# Altium schematic sheet ETH-Debug.SchDoc
size OrCAD B; SheetNumber: 6; SheetTotal: 10
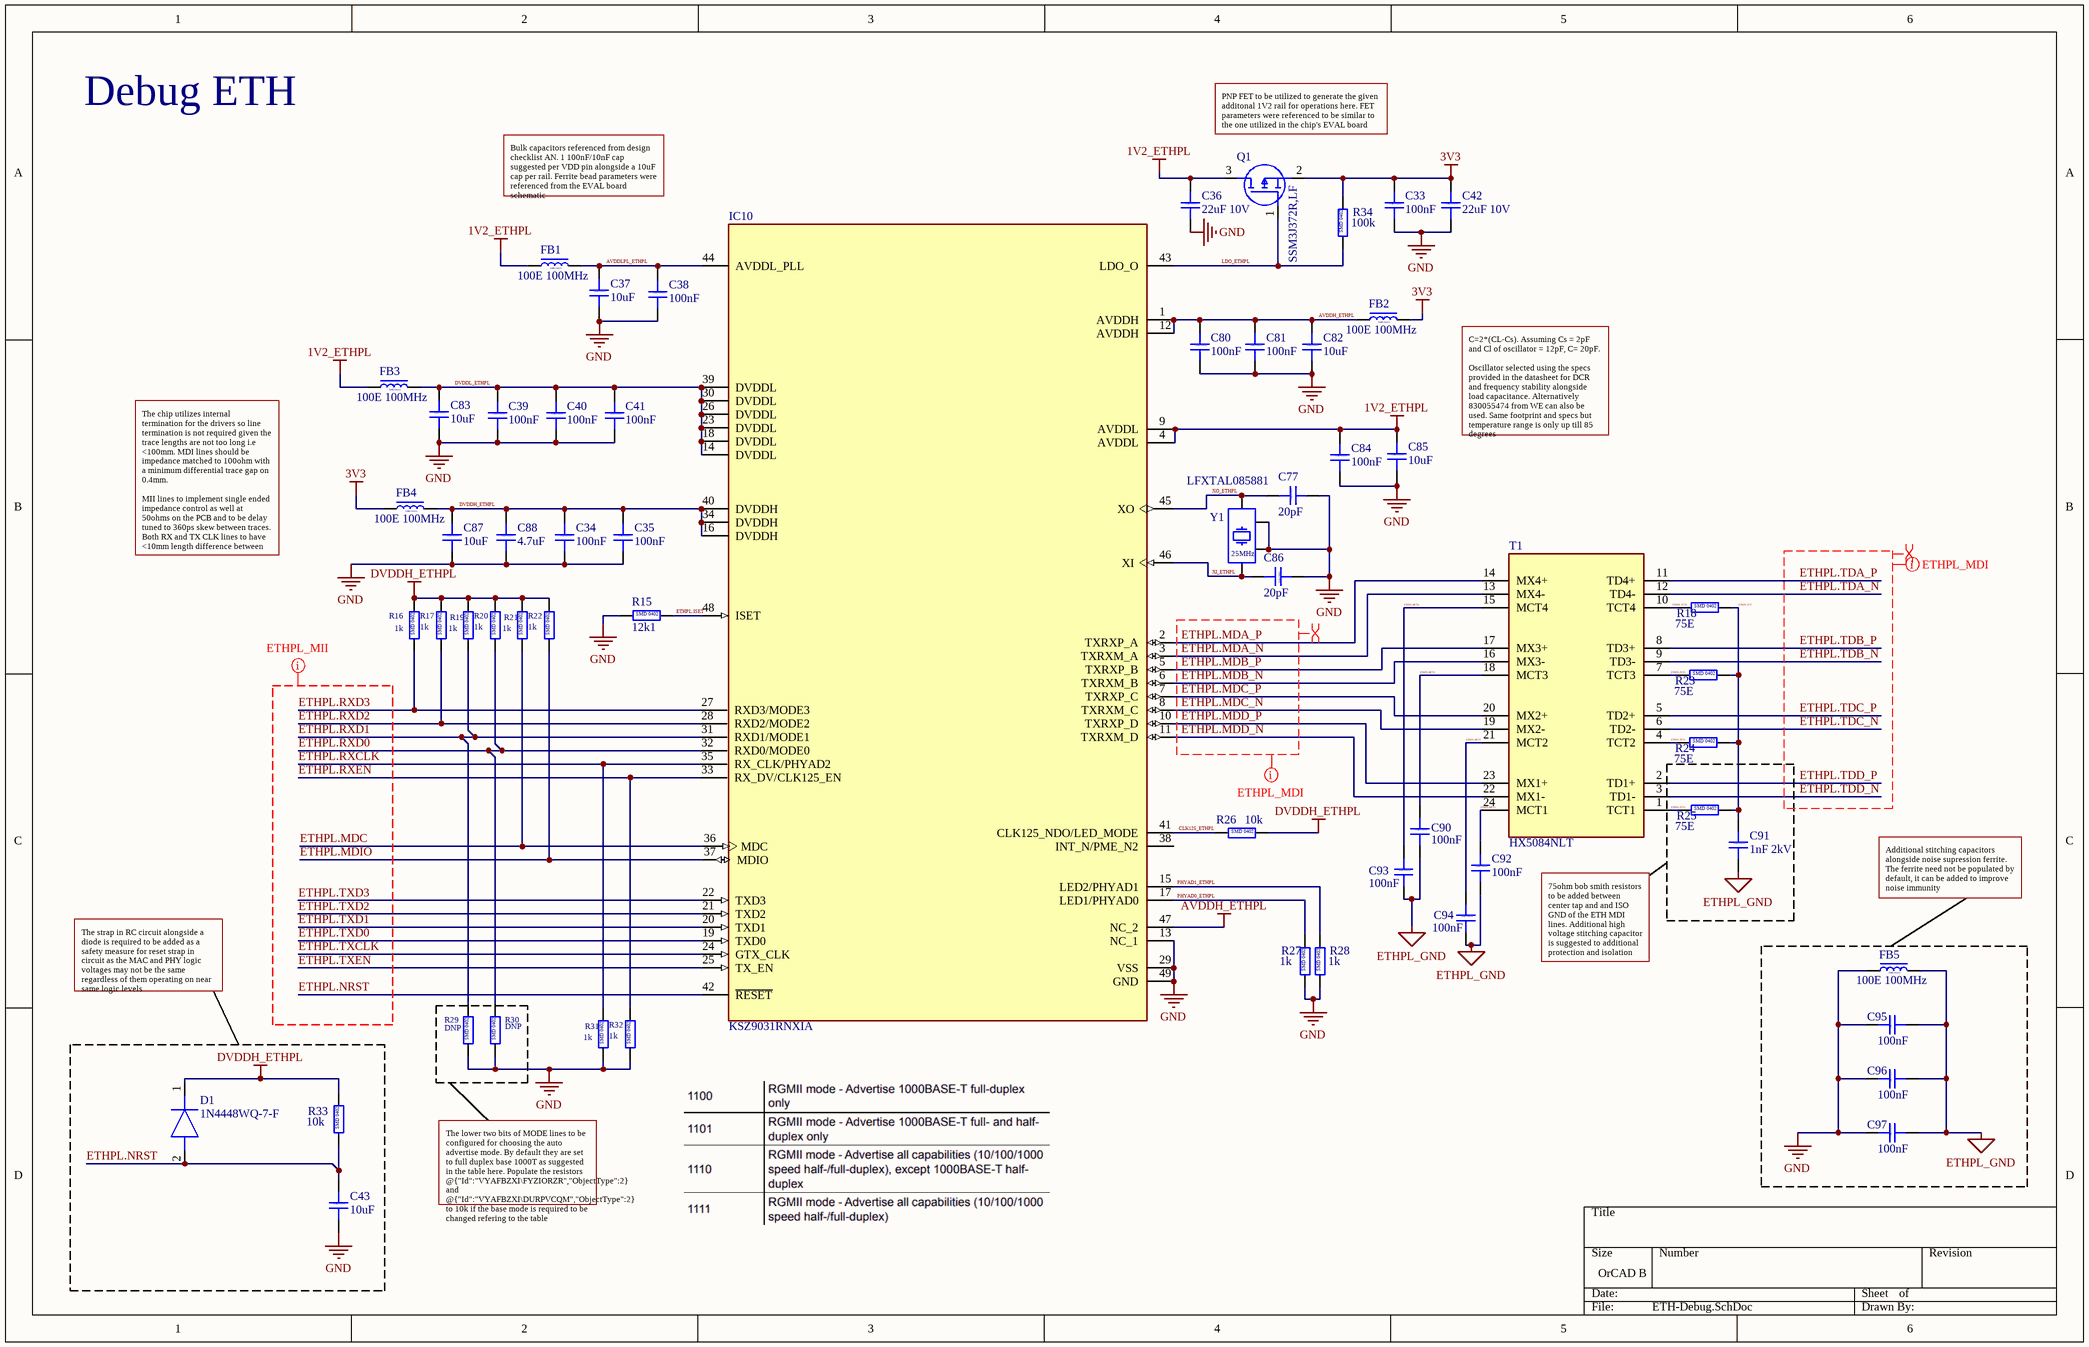
[diagram p0: ETH-Debug.SchDoc]

## Parts
C33  100nF  [CAP_0402]
C34  100nF  [CAP_0402]
C35  100nF  [CAP_0402]
C36  22uF 10V  [CAP_0805]
C37  10uF  [CAP_0603]
C38  100nF  [CAP_0402]
C39  100nF  [CAP_0402]
C40  100nF  [CAP_0402]
C41  100nF  [CAP_0402]
C42  22uF 10V  [CAP_0805]
C43  10uF  [CAP_0603]
C77  20pF  [CAP_0402]
C80  100nF  [CAP_0402]
C81  100nF  [CAP_0402]
C82  10uF  [CAP_0603]
C83  10uF  [CAP_0603]
C84  100nF  [CAP_0402]
C85  10uF  [CAP_0603]
C86  20pF  [CAP_0402]
C87  10uF  [CAP_0603]
C88  4.7uF  [CAP_0603]
C90  100nF  [CAP_0402]
C91  1nF 2kV  [CAP_0402]
C92  100nF  [CAP_0402]
C93  100nF  [CAP_0402]
C94  100nF  [CAP_0402]
C95  100nF  [CAP_0402]
C96  100nF  [CAP_0402]
C97  100nF  [CAP_0402]
D1  1N4448WQ-7-F  [SOD3716X135N]
FB1  100E 100MHz  [FB_0603]
FB2  100E 100MHz  [FB_0603]
FB3  100E 100MHz  [FB_0603]
FB4  100E 100MHz  [FB_0603]
FB5  100E 100MHz  [FB_0603]
IC10  KSZ9031RNXIA  [QFN50P700X700X90-49N]
Q1  SSM3J372R,LF  [SSM3J372RLF]
R15  12k1  [RES_0402]
R16  1k  [RES_0402]
R17  1k  [RES_0402]
R18  75E  [RES_0402]
R19  1k  [RES_0402]
R20  1k  [RES_0402]
R21  1k  [RES_0402]
R22  1k  [RES_0402]
R23  75E  [RES_0402]
R24  75E  [RES_0402]
R25  75E  [RES_0402]
R26  10k  [RES_0402]
R27  1k  [RES_0402]
R28  1k  [RES_0402]
R29  DNP  [RES_0402]
R30  DNP  [RES_0402]
R31  1k  [RES_0402]
R32  1k  [RES_0402]
R33  10k  [RES_0402]
R34  100k  [RES_0402]
T1  HX5084NLT  [HX5084NLT]
Y1  LFXTAL085881  [CRY-SMD-3225]

## Nets
1V2_ETHPL: C36.1 C84.1 C85.1 FB1.1 FB3.1 IC10.4(AVDDL) IC10.9(AVDDL) Q1.3(D)
3V3: C33.1 C42.1 FB2.2 FB4.1 Q1.2(S) R34.2
AVDDH_ETHPL: C80.1 C81.1 C82.1 FB2.1 IC10.1(AVDDH) IC10.12(AVDDH) IC10.47(NC_2)
DVDDH_ETHPL: C34.1 C35.1 C87.1 C88.1 D1.1(K) FB4.2 IC10.16(DVDDH) IC10.34(DVDDH) IC10.40(DVDDH) R16.2 R17.2 R19.2 R20.2 R21.2 R22.2 R26.2 R33.2
ETHPL_GND: C90.2 C91.2 C92.2 C93.2 C94.2 C95.2 C96.2 C97.2 FB5.2
GND: C33.2 C34.2 C35.2 C36.2 C37.2 C38.2 C39.2 C40.2 C41.2 C42.2 C43.2 C77.2 C80.2 C81.2 C82.2 C83.2 C84.2 C85.2 C86.1 C87.2 C88.2 C95.1 C96.1 C97.1 FB5.1 IC10.13(NC_1) IC10.29(VSS) IC10.49(GND) R15.1 R27.1 R28.1 R29.1 R30.1 R31.1 R32.1 Y1.2 Y1.4
AVDDLPL_ETHPL: C37.1 C38.1 FB1.2 IC10.44(AVDDL_PLL)
CLK125_ETHPL: IC10.41(CLK125_NDO/LED_MODE) R26.1
DVDDL_ETHPL: C39.1 C40.1 C41.1 C83.1 FB3.2 IC10.14(DVDDL) IC10.18(DVDDL) IC10.23(DVDDL) IC10.26(DVDDL) IC10.30(DVDDL) IC10.39(DVDDL)
ETHPL.ISET: IC10.48(ISET) R15.2
ETHPL.MCT1: C92.1 T1.24(MCT1)
ETHPL.MCT2: C94.1 T1.21(MCT2)
ETHPL.MCT3: C90.1 T1.18(MCT3)
ETHPL.MCT4: C93.1 T1.15(MCT4)
ETHPL.MDA_N: IC10.3(TXRXM_A) T1.13(MX4-)
ETHPL.MDA_P: IC10.2(TXRXP_A) T1.14(MX4+)
ETHPL.MDB_N: IC10.6(TXRXM_B) T1.16(MX3-)
ETHPL.MDB_P: IC10.5(TXRXP_B) T1.17(MX3+)
ETHPL.MDC: IC10.36(MDC) R21.1
ETHPL.MDC_N: IC10.8(TXRXM_C) T1.19(MX2-)
ETHPL.MDC_P: IC10.7(TXRXP_C) T1.20(MX2+)
ETHPL.MDD_N: IC10.11(TXRXM_D) T1.22(MX1-)
ETHPL.MDD_P: IC10.10(TXRXP_D) T1.23(MX1+)
ETHPL.MDIO: IC10.37(MDIO) R22.1
ETHPL.NRST: C43.1 D1.2(A) IC10.42(~{RESET}) R33.1
ETHPL.RXCLK: IC10.35(RX_CLK/PHYAD2) R31.2
ETHPL.RXD0: IC10.32(RXD0/MODE0) R20.1 R30.2
ETHPL.RXD1: IC10.31(RXD1/MODE1) R19.1 R29.2
ETHPL.RXD2: IC10.28(RXD2/MODE2) R17.1
ETHPL.RXD3: IC10.27(RXD3/MODE3) R16.1
ETHPL.RXEN: IC10.33(RX_DV/CLK125_EN) R32.2
ETHPL.TCT: C91.1 R18.2 R23.2 R24.2 R25.2
ETHPL.TCT1: R25.1 T1.1(TCT1)
ETHPL.TCT2: R24.1 T1.4(TCT2)
ETHPL.TCT3: R23.1 T1.7(TCT3)
ETHPL.TCT4: R18.1 T1.10(TCT4)
ETHPL.TDA_N: T1.12(TD4-)
ETHPL.TDA_P: T1.11(TD4+)
ETHPL.TDB_N: T1.9(TD3-)
ETHPL.TDB_P: T1.8(TD3+)
ETHPL.TDC_N: T1.6(TD2-)
ETHPL.TDC_P: T1.5(TD2+)
ETHPL.TDD_N: T1.3(TD1-)
ETHPL.TDD_P: T1.2(TD1+)
ETHPL.TXCLK: IC10.24(GTX_CLK)
ETHPL.TXD0: IC10.19(TXD0)
ETHPL.TXD1: IC10.20(TXD1)
ETHPL.TXD2: IC10.21(TXD2)
ETHPL.TXD3: IC10.22(TXD3)
ETHPL.TXEN: IC10.25(TX_EN)
LDO_ETHPL: IC10.43(LDO_O) Q1.1(G) R34.1
PHYAD0_ETHPL: IC10.17(LED1/PHYAD0) R27.2
PHYAD1_ETHPL: IC10.15(LED2/PHYAD1) R28.2
XI_ETHPL: C86.2 IC10.46(XI) Y1.1
XO_ETHPL: C77.1 IC10.45(XO) Y1.3

Not connected (* = marked no-connect by the designer): IC10 38(INT_N/PME_N2)

## Layout directives
net class ETHPL_MII; rule Maximum Via Count Constraint [Max Count = 2]; rule Matched Net Lengths [Delay Tolerance = 360ps]: ETHPL.MDC, ETHPL.MDIO, ETHPL.NRST, ETHPL.RXCLK, ETHPL.RXD0, ETHPL.RXD1, ETHPL.RXD2, ETHPL.RXD3, ETHPL.RXEN, ETHPL.TXCLK, ETHPL.TXD0, ETHPL.TXD1, ETHPL.TXD2, ETHPL.TXD3, ETHPL.TXEN
differential pair: ETHPL.MDA_N, ETHPL.MDA_P, ETHPL.MDB_N, ETHPL.MDB_P, ETHPL.MDC_N, ETHPL.MDC_P, ETHPL.MDD_N, ETHPL.MDD_P, ETHPL.TDA_N, ETHPL.TDA_P, ETHPL.TDB_N, ETHPL.TDB_P, ETHPL.TDC_N, ETHPL.TDC_P, ETHPL.TDD_N, ETHPL.TDD_P
net class ETHPL_MDI; rule Maximum Via Count Constraint [Max Count = 2]; rule Matched Net Lengths [Delay Tolerance = 100ps]: ETHPL.MDA_N, ETHPL.MDA_P, ETHPL.MDB_N, ETHPL.MDB_P, ETHPL.MDC_N, ETHPL.MDC_P, ETHPL.MDD_N, ETHPL.MDD_P, ETHPL.TDA_N, ETHPL.TDA_P, ETHPL.TDB_N, ETHPL.TDB_P, ETHPL.TDC_N, ETHPL.TDC_P, ETHPL.TDD_N, ETHPL.TDD_P

## Notes on the sheet
- Debug ETH
- PNP FET to be utilized to generate the given additonal 1V2 rail for operations here. FET parameters were referenced to be similar to the one utilized in the chip's EVAL board
- Bulk capacitors referenced from design checklist AN. 1 100nF/10nF cap suggested per VDD pin alongside a 10uF cap per rail. Ferrite bead parameters were referenced from the EVAL board schematic
- C=2*(CL-Cs). Assuming Cs = 2pF and Cl of oscillator = 12pF, C= 20pF.
  Oscillator selected using the specs provided in the datasheet for DCR and frequency stability alongside load capacitance. Alternatively 830055474 from WE can also be used. Same footprint and specs but temperature range is only up till 85 degrees
- The chip utilizes internal termination for the drivers so line termination is not required given the trace lengths are not too long i.e <100mm. MDI lines should be impedance matched to 100ohm with a minimum differential trace gap on 0.4mm.
  MII lines to implement single ended impedance control as well at 50ohms on the PCB and to be delay tuned to 360ps skew between traces.  Both RX and TX CLK lines to have <10mm length difference between each other
- Additional stitching capacitors alongside noise supression ferrite. The ferrite need not be populated by default, it can be added to improve noise immunity
- 75ohm bob smith resistors to be added between center tap and and ISO GND of the ETH MDI lines. Additional high voltage stitching capacitor is suggested to additional protection and isolation
- The strap in RC circuit alongside a diode is required to be added as a safety measure for reset strap in circuit as the MAC and PHY logic voltages may not be the same regardless of them operating on near same logic levels
- The lower two bits of MODE lines to be configured for choosing the auto advertise mode. By default they are set to full duplex base 1000T as suggested in the table here. Populate the resistors @{"Id":"VYAFBZXI\FYZIORZR","ObjectType":2} and @{"Id":"VYAFBZXI\DURPVCQM","ObjectType":2} to 10k if the base mode is required to be changed refering to the table
- (in symbol Capacitor-SMD-0402) SMD 0402
- (in symbol Capacitor-SMD-0603) SMD 0603
- (in symbol Capacitor-SMD-0805) SMD 0805
- (in symbol FB_0603) SMD 0603
- (in symbol LFXTAL085881) 25MHz
- (in symbol Resistor-SMD-0402) SMD 0402

## Library data of the parts
C33-C35 C38-C41 C77 C80 C81 C84 C86 C90-C97 = Capacitor-SMD-0402: Capacitor SMD 0402 RATED
C36 C42 = Capacitor-SMD-0805: Capacitor SMD 0805 RATED
C37 C43 C82 C83 C85 C87 C88 = Capacitor-SMD-0603: Capacitor SMD 0603 RATED
D1 = 1N4448WQ-7-F: Diode 100V 4A; Manufacturer_Name: Diodes Incorporated; Datasheet Link: http://www.mouser.com/ds/2/115/ds12002-536532.pdf; Height: 1.35mm; Manufacturer_Part_Number: 1N4448WQ-7-F; Mouser Part Number: 621-1N4448WQ-7-F; Mouser Price/Stock: https://www.mouser.co.uk/ProductDetail/Diodes-Incorporated/1N4448WQ-7-F?qs=s5XU71A7K78gaRcR8oskdg%3D%3D; Arrow Part Number: 1N4448WQ-7-F; Arrow Price/Stock: https://www.arrow.com/en/products/1n4448wq-7-f/diodes-incorporated?utm_currency=USD&region=nac
FB1-FB5 = FB_0603: Ferrite Bead SMD 0603; Manufacturer: *; Manufacturer Part Number: *; Distributor Link: *; LCSC: *
IC10 = KSZ9031RNXIA: RGMII Ethernet Transceiver with VDDL LDO; Manufacturer_Name: Microchip; Datasheet Link: https://ww1.microchip.com/downloads/en/devicedoc/00002117f.pdf; Height: 0.9mm; Manufacturer_Part_Number: KSZ9031RNXIA; Mouser Part Number: 998-KSZ9031RNXIA; Mouser Price/Stock: https://www.mouser.co.uk/ProductDetail/Microchip-Technology/KSZ9031RNXIA?qs=lBdOJv1PVCGadCZMzb63mg%3D%3D; Arrow Part Number: KSZ9031RNXIA; Arrow Price/Stock: https://www.arrow.com/en/products/ksz9031rnxia/microchip-technology?region=europe
Q1 = SSM3J372R,LF: MOSFET (P-Channel); Manufacturer_Name: Toshiba; Datasheet Link: https://toshiba.semicon-storage.com/ap-en/semiconductor/product/mosfets/detail.SSM3J372R.html; Height: 0.88mm; Manufacturer_Part_Number: SSM3J372R,LF; Mouser Part Number: 757-SSM3J372RLF; Mouser Price/Stock: https://www.mouser.co.uk/ProductDetail/Toshiba/SSM3J372RLF?qs=u16ybLDytRbJaSMlwq9MLA%3D%3D; Arrow Part Number: SSM3J372R,LF; Arrow Price/Stock: null?utm_currency=USD&region=nac
R15-R34 = Resistor-SMD-0402: Resistor SMD 0402 RATED
T1 = HX5084NLT: Ethernet Signal Transformer; Manufacturer_Name: YAGEO; Datasheet Link: https://productfinder.pulseelectronics.com/api/open/part-attachments/datasheet/hx5084nlt; Height: 4.1402mm; Manufacturer_Part_Number: HX5084NLT; Mouser Part Number: 673-HX5084NLT; Mouser Price/Stock: https://www.mouser.co.uk/ProductDetail/Pulse-Electronics/HX5084NLT?qs=afupL77xwePI46UjbaB5Gg%3D%3D; Arrow Part Number: HX5084NLT; Arrow Price/Stock: https://www.arrow.com/en/products/hx5084nlt/pulse-electronics-corporation?utm_currency=USD&region=nac
Y1 = LFXTAL085881: Crystal Oscillator 25MHz; Manufacturer_Name: IDQ; Datasheet Link: https://www.mouser.in/datasheet/3/1460/1/LFXTAL085881.pdf; Height: 0.8mm; Manufacturer_Part_Number: LFXTAL085881